# Altium schematic sheet GD_Power_Meter_2.SchDoc: Meter_1
size A3
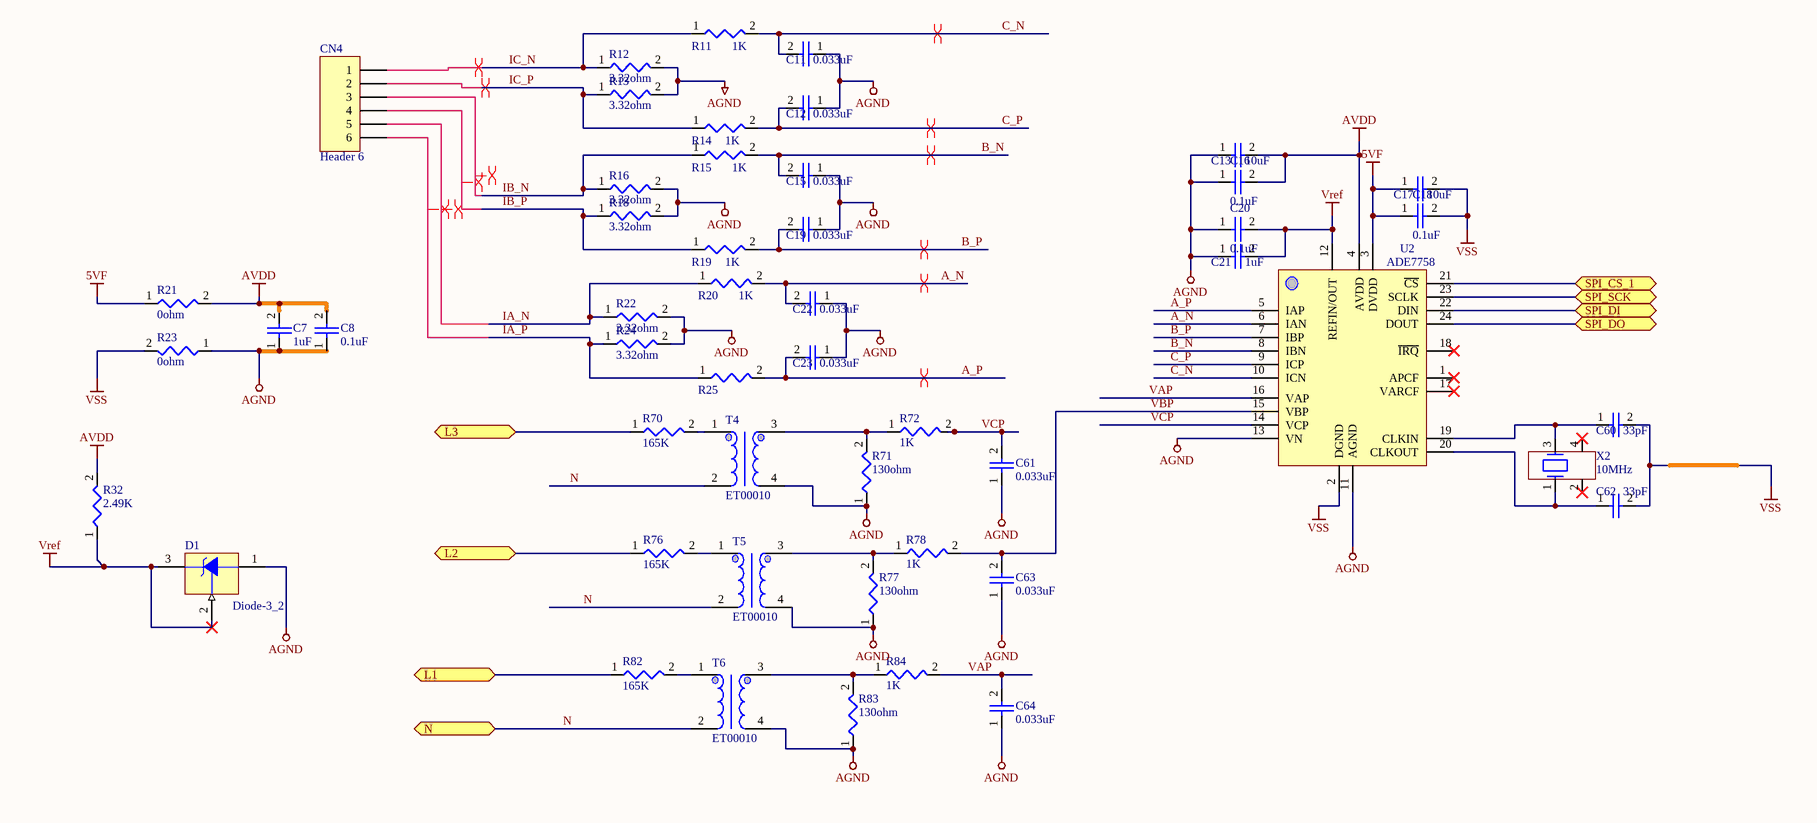
[diagram p0: GD_Power_Meter_2.SchDoc]

## Parts
C7  value 1uF  [C0805]  (hidden comment: CAP)
C8  value 0.1uF  [C0805]  (hidden comment: CAP)
C11  value 0.033uF  [C0805]  (hidden comment: CAP)
C12  value 0.033uF  [C0805]  (hidden comment: CAP)
C13  10uF  [C0805]
C15  value 0.033uF  [C0805]  (hidden comment: CAP)
C16  value 0.1uF  [C0805]  (hidden comment: CAP)
C17  10uF  [C0805]
C18  value 0.1uF  [C0805]  (hidden comment: CAP)
C19  value 0.033uF  [C0805]  (hidden comment: CAP)
C20  value 0.1uF  [C0805]  (hidden comment: CAP)
C21  value 1uF  [C0805]  (hidden comment: CAP)
C22  value 0.033uF  [C0805]  (hidden comment: CAP)
C23  value 0.033uF  [C0805]  (hidden comment: CAP)
C60  value 33pF  [C0805]  (hidden comment: CAP)
C61  value 0.033uF  [C0805]  (hidden comment: CAP)
C62  value 33pF  [C0805]  (hidden comment: CAP)
C63  value 0.033uF  [C0805]  (hidden comment: CAP)
C64  value 0.033uF  [C0805]  (hidden comment: CAP)
CN4  Header 6  [HT5.08-6P-H]
D1  Diode-3_2  [SOT23-321]
R11  value 1K  [R0805]  (hidden comment: RES)
R12  value 3.32ohm  [R0805]  (hidden comment: RES)
R13  value 3.32ohm  [R0805]  (hidden comment: RES)
R14  value 1K  [R0805]  (hidden comment: RES)
R15  value 1K  [R0805]  (hidden comment: RES)
R16  value 3.32ohm  [R0805]  (hidden comment: RES)
R18  value 3.32ohm  [R0805]  (hidden comment: RES)
R19  value 1K  [R0805]  (hidden comment: RES)
R20  value 1K  [R0805]  (hidden comment: RES)
R21  value 0ohm  [R0805]  (hidden comment: RES)
R22  value 3.32ohm  [R0805]  (hidden comment: RES)
R23  value 0ohm  [R0805]  (hidden comment: RES)
R24  value 3.32ohm  [R0805]  (hidden comment: RES)
R25  RES  [R0805]  (value not drawn)
R32  value 2.49K  [R0805]  (hidden comment: RES)
R70  value 165K  [MFR5W2P5]  (hidden comment: RES)
R71  value 130ohm  [R0805]  (hidden comment: RES)
R72  value 1K  [R0805]  (hidden comment: RES)
R76  value 165K  [MFR5W2P5]  (hidden comment: RES)
R77  value 130ohm  [R0805]  (hidden comment: RES)
R78  value 1K  [R0805]  (hidden comment: RES)
R82  value 165K  [MFR5W2P5]  (hidden comment: RES)
R83  value 130ohm  [R0805]  (hidden comment: RES)
R84  value 1K  [R0805]  (hidden comment: RES)
T4  ET00010  [ZMPT107]
T5  ET00010  [ZMPT107]
T6  ET00010  [ZMPT107]
U2  ADE7758  [SOIC24-W]
X2  value 10MHz  [XTAL_5X3_2]  (hidden comment: ABM3C)

## Ports
L1, L2, L3, N, SPI_CS_1, SPI_DI, SPI_DO (bidir), SPI_SCK

## Nets
5VF: C17.1 C18.1 R21.1 U2.3(DVDD)
AGND: C7.1 C8.1 C11.1 C12.1 C13.1 C15.1 C16.1 C19.1 C20.1 C21.1 C22.1 C23.1 C61.1 C63.1 C64.1 D1.1(A) R12.2 R13.2 R16.2 R18.2 R22.2 R23.1 R24.2 R71.1 R77.1 R83.1 T4.4 T5.4 T6.4 U2.11(AGND) U2.13(VN)
AVDD: C7.2 C8.2 C13.2 C16.2 R21.2 R32.2 U2.4(AVDD)
Vref: C20.2 C21.2 D1.2(R) D1.3(C) R32.1 U2.12(REFIN/OUT)
VSS: C17.2 C18.2 C60.2 C62.2 R23.2 U2.2(DGND)
A_N: C22.2 R20.2 U2.6(IAN)
A_P: C23.2 R25.2 U2.5(IAP)
B_N: C15.2 R15.2 U2.8(IBN)
B_P: C19.2 R19.2 U2.7(IBP)
C_N: C11.2 R11.2 U2.10(ICN)
C_P: C12.2 R14.2 U2.9(ICP)
IA_N: CN4.5 R20.1 R22.1
IA_P: CN4.6 R24.1 R25.1
IB_N: CN4.3 R15.1 R16.1
IB_P: CN4.4 R18.1 R19.1
IC_N: CN4.1 R11.1 R12.1
IC_P: CN4.2 R13.1 R14.1
L1: R82.1 ; port L1
L2: R76.1 ; port L2
L3: R70.1 ; port L3
N: T4.2 T5.2 T6.2 ; port N
SPI_CS_1: U2.21(~{CS}) ; port SPI_CS_1
SPI_DI: U2.22(DIN) ; port SPI_DI
SPI_DO: U2.24(DOUT) ; port SPI_DO
SPI_SCK: U2.23(SCLK) ; port SPI_SCK
VAP: C64.2 R84.2 U2.16(VAP)
VBP: C63.2 R78.2 U2.15(VBP)
VCP: C61.2 R72.2 U2.14(VCP)
NetC60_1: C60.1 U2.19(CLKIN) X2.3
NetC62_1: C62.1 U2.20(CLKOUT) X2.1
NetR70_2: R70.2 T4.1
NetR71_2: R71.2 R72.1 T4.3
NetR76_2: R76.2 T5.1
NetR77_2: R77.2 R78.1 T5.3
NetR82_2: R82.2 T6.1
NetR83_2: R83.2 R84.1 T6.3

Not connected (* = marked no-connect by the designer): U2 1(APCF)* 17(VARCF)* 18(~{IRQ})*; X2 2* 4*

## Layout directives
differential pair: A_N, A_P, B_N, B_P, C_N, C_P, IA_N, IA_P, IB_N, IB_P, IC_N, IC_P

## Library data of the parts
C7 C21 = EC00002: CAP SMD CR X7R 50V 10% 1uF 0805 ROHS; Manufacturer: YAGEO; Manufacturer P/N: CC0805KKX7R9BB105; ID: 2; HelpURL: *; P/N: EC00002
C8 C16 C18 C20 = EC00014: CAP SMD CR X7R 50V 10% 0.1uF 0805 ROHS; Manufacturer: YAGEO; Manufacturer P/N: CC0805KRX7R9BB104; ID: 14; HelpURL: *; P/N: EC00014
C11 C12 C15 C19 C22 C23 C61 C63 C64 = EC00079: CAP SMD X7R 50V 10% 0.033uF 0805 ROHS; Manufacturer: Murata; Manufacturer P/N: GRM219R71H333KA01; ID: 79; HelpURL: \\192.168.1.3\Esh\Department\RD\CAD\Component\Capacitor\smd\Murata_mpdf.pdf; P/N: EC00079
C13 C17 = EC00034: CAP SMD CR X5R 16V 10% 10uF 0805 ROHS; Manufacturer: Murata; Manufacturer P/N: GRM21BR61C106KE15; Value: 10uF_16V; ID: 34; Type: ****; HelpURL: *; P/N: EC00034
C60 C62 = EC00017: CAP SMD C0G 50V 5% 33pF 0805 ROHS; Manufacturer: YAGEO; Manufacturer P/N: CC0805JRNPO9BN330; ID: 17; HelpURL: \\192.168.1.3\Esh\Department\RD\CAD\Component\Capacitor\smd\Murata_GQM2195C1H330JB01D.pdf; P/N: EC00017
CN4 = Header 6: Header, 6-Pin; Manufacturer P/N: HT5.08-6P Bend; P/N: EE00007; Manufacturer: *
D1 = EU00043: IC PROGRAMMABLE PRECISION REFERENCES,2.5-20V,0.5%,SMD,ROHS; Manufacturer: DIODES; Manufacturer P/N: ZTL431BFTA; ID: 43; Value: ZTL431BFTA; Type: *****; HelpURL: \\192.168.1.3\Esh\Department\RD\CAD\Component\TL431\ZTL431_432.pdf; P/N: EU00043
R11 R14 R15 R19 R20 R25 R72 R78 R84 = ER00028: RES THICK_FILM SMD 1K 1% 1/8W ROHS 0805; Manufacturer: YAGEO; Manufacturer P/N: RC0805FR-071KL; ID: 28; P/N: ER00028
  R11 R14 R15 R19 R20 R25: HelpURL: *
  R72 R78 R84: HelpURL: \\192.168.1.3\Esh\Department\RD\CAD\Component\Resistor\RC0805-257173.pdf
R12 R13 R16 R18 R22 R24 = ER00273: RES THIN_FILM SMD 3.32 ohm 0.5% 1/8W ±50ppm/℃ ROHS 0805; Manufacturer: YAGEO; Manufacturer P/N: RT0805DRE073R32; ID: 273; HelpURL: *; P/N: ER00273
R21 R23 = ER00026: RES THICK_FILM SMD 0 OHM 5% 1/8W ROHS 0805; Manufacturer: YAGEO; Manufacturer P/N: RC0805JR-070RL; ID: 26; HelpURL: *; P/N: ER00026
R32 = ER00108: RES THICK_FILM 2.49K 1% 1/8W ROHS SMD 0805; Manufacturer: YAGEO; Manufacturer P/N: RC0805FR-072K49L; ID: 108; HelpURL: *; P/N: ER00108
R70 R76 R82 = ER00275: RES Film Leaded 165K 0.5% 3W ROHS ±25ppm/℃ MFR1550; Manufacturer: Viking; Manufacturer P/N: MFR1550DACR1653; ID: 275; HelpURL: *; P/N: ER00275
R71 R77 R83 = ER00280: RES,THIN_FILM,130 ohm,0.5%	,1/10W,±25ppm/℃,ROHS,0805,SMD; Manufacturer: VIKING; Manufacturer P/N: AR05DTC1300; ID: 280; HelpURL: *; P/N: ER00280
T4-T6 = ET00010: Voltage transformer,2mA/2mA,THT,ROHS; Manufacturer: ZEMING; Value: ZMPT107; ID: 10; HelpURL: *; P/N: ET00010; Manufacturer P/N: ZMPT107
U2 = EU00042: IC Energy Measurement,Irms,VA,VAR,Vrms,Watt,Output:Pulsed&SPI,SOIC_W-24,ROHS; Manufacturer P/N: ADE7758ARWZRL; Manufacturer: ANALOG DEVICES; ID: 42; Value: ADE7758ARWZRL; HelpURL: \\192.168.1.3\Esh\Department\RD\CAD\Component\Energy Measurement\ADE7758.pdf; P/N: EU00042; Type: *****
X2 = EX00008: XTAL 10MHz 18PF +/-30PPM,3.2mmWx5mmLx1.3mmH,-40~85,RoHS,SMD; Manufacturer: ABRACON; Manufacturer P/N: ABM3C-10.000MHZ-D4Y-T; ID: 8; HelpURL: \\192.168.1.3\Esh\Department\RD\CAD\Component\Crystal\abracon_abm3c.pdf; P/N: EX00008; Type: *****